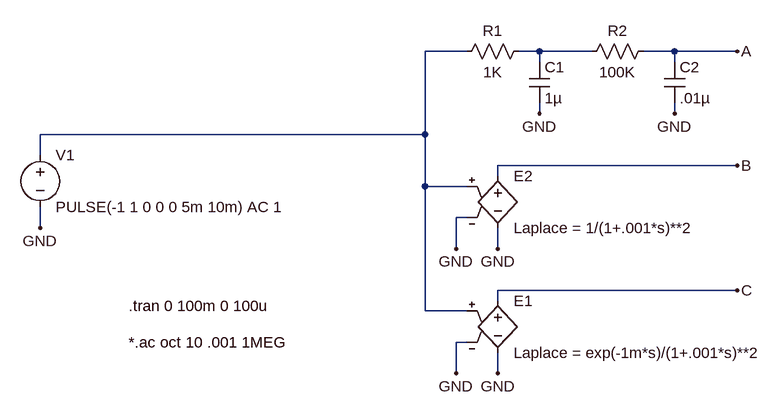
[diagram p0: schematic TwoTau.asc]
TwoTau.asc, the LTspice schematic file:
Version 4
SHEET 1 1576 840
WIRE 992 464 1056 464
WIRE 400 416 400 384
WIRE 400 384 992 384
WIRE 992 384 992 464
WIRE 400 496 400 528
WIRE 1104 432 1472 432
WIRE 992 256 1056 256
WIRE 992 384 992 256
WIRE 1376 256 1472 256
WIRE 1104 448 1104 432
WIRE 1104 528 1104 560
WIRE 1104 624 1472 624
WIRE 1056 512 1040 512
WIRE 1040 512 1040 560
WIRE 1168 272 1168 256
WIRE 1168 256 1136 256
WIRE 1168 336 1168 352
WIRE 1376 272 1376 256
WIRE 1376 256 1328 256
WIRE 1376 336 1376 352
WIRE 1248 256 1168 256
WIRE 992 656 1056 656
WIRE 1104 640 1104 624
WIRE 1104 720 1104 752
WIRE 1056 704 1040 704
WIRE 1040 704 1040 752
WIRE 992 656 992 464
FLAG 400 528 GND
FLAG 1472 432 B
FLAG 1472 256 A
FLAG 1104 560 GND
FLAG 1472 624 C
FLAG 1040 560 GND
FLAG 1168 352 GND
FLAG 1376 352 GND
FLAG 1104 752 GND
FLAG 1040 752 GND
SYMBOL voltage 400 400 R0
SYMATTR InstName V1
SYMATTR Value PULSE(-1 1 0 0 0 5m 10m) AC 1
SYMBOL e 1104 432 R0
SYMATTR InstName E2
SYMATTR Value Laplace = 1/(1+.001*s)**2
SYMBOL res 1152 240 R90
WINDOW 0 0 56 VBottom 0
WINDOW 3 32 56 VTop 0
SYMATTR InstName R1
SYMATTR Value 1K
SYMBOL cap 1152 272 R0
SYMATTR InstName C1
SYMATTR Value 1µ
SYMBOL res 1344 240 R90
WINDOW 0 0 56 VBottom 0
WINDOW 3 32 56 VTop 0
SYMATTR InstName R2
SYMATTR Value 100K
SYMBOL cap 1360 272 R0
SYMATTR InstName C2
SYMATTR Value .01µ
SYMBOL e 1104 624 R0
SYMATTR InstName E1
SYMATTR Value Laplace = exp(-1m*s)/(1+.001*s)**2
TEXT 536 704 Left 0 !*.ac oct 10 .001 1MEG
TEXT 536 648 Left 0 !.tran 0 100m 0 100u

The netlist it stands for:
* TwoTau.asc
V1 N001 GND PULSE(-1 1 0 0 0 5m 10m) AC 1
E2 B GND N001 GND Laplace = 1/(1+.001*s)**2
R1 N002 N001 1K
C1 N002 GND 1µ
R2 A N002 100K
C2 A GND .01µ
E1 C GND N001 GND Laplace = exp(-1m*s)/(1+.001*s)**2
*.ac oct 10 .001 1MEG
.tran 0 100m 0 100u
.backanno
.end